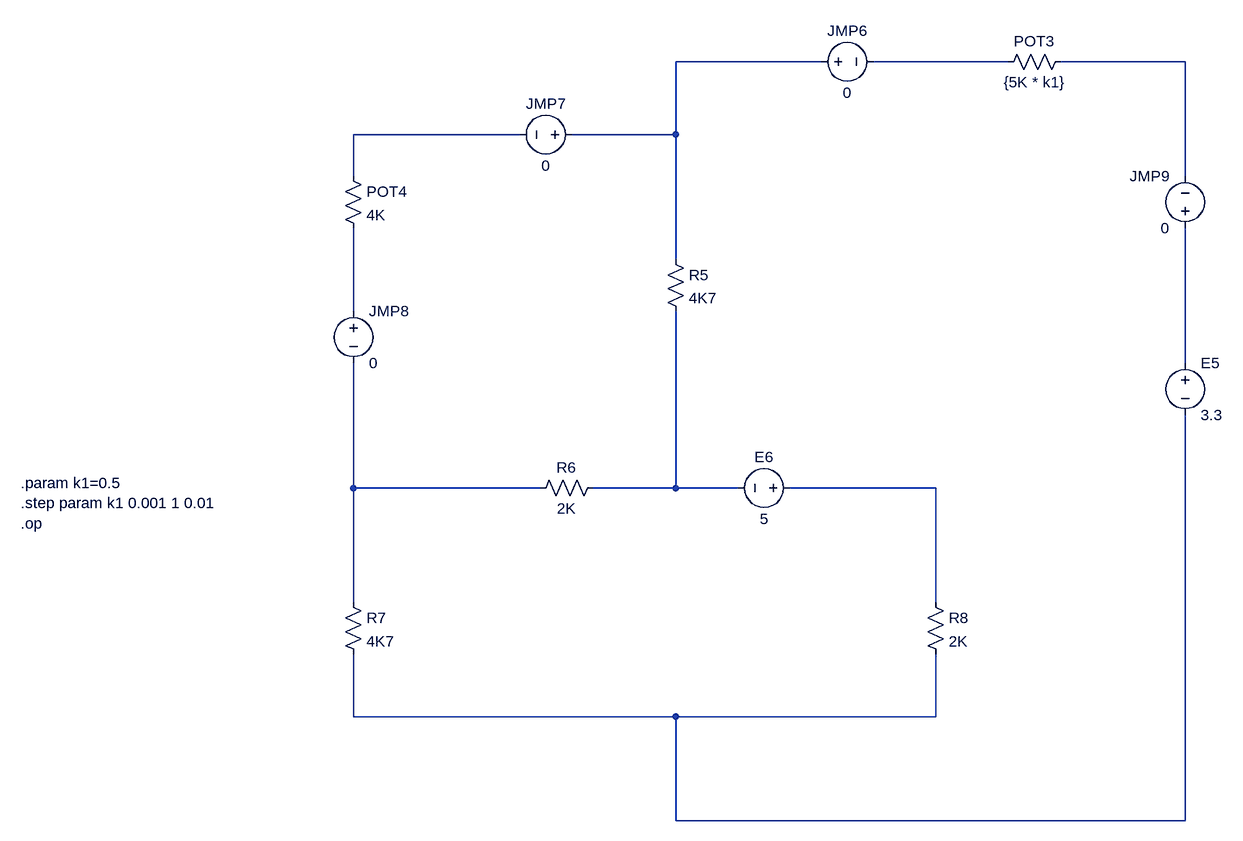
[diagram p0: schematic lab33.asc]
lab33.asc, the LTspice schematic file:
Version 4.1
SHEET 1 880 692
WIRE 208 -480 -16 -480
WIRE 496 -480 288 -480
WIRE 768 -480 576 -480
WIRE -256 -368 -512 -368
WIRE -16 -368 -16 -480
WIRE -16 -368 -176 -368
WIRE -512 -304 -512 -368
WIRE 768 -304 768 -480
WIRE -16 -176 -16 -368
WIRE -512 -96 -512 -224
WIRE 768 -16 768 -224
WIRE -512 176 -512 -16
WIRE -224 176 -512 176
WIRE -16 176 -16 -96
WIRE -16 176 -144 176
WIRE 80 176 -16 176
WIRE 384 176 160 176
WIRE -512 352 -512 176
WIRE 384 352 384 176
WIRE -512 528 -512 432
WIRE -16 528 -512 528
WIRE 384 528 384 432
WIRE 384 528 -16 528
WIRE -16 688 -16 528
WIRE 768 688 768 64
WIRE 768 688 -16 688
SYMBOL voltage 176 176 R90
WINDOW 0 -32 56 VBottom 2
WINDOW 3 32 56 VTop 2
WINDOW 123 0 0 Left 0
WINDOW 39 0 0 Left 0
SYMATTR InstName E6
SYMATTR Value 5
SYMBOL voltage 768 -32 R0
SYMATTR InstName E5
SYMATTR Value 3.3
SYMBOL res -528 336 R0
SYMATTR InstName R7
SYMATTR Value 4K7
SYMBOL res -128 160 R90
WINDOW 0 0 56 VBottom 2
WINDOW 3 32 56 VTop 2
SYMATTR InstName R6
SYMATTR Value 2K
SYMBOL res 368 336 R0
SYMATTR InstName R8
SYMATTR Value 2K
SYMBOL res -528 -320 R0
SYMATTR InstName POT4
SYMATTR Value 4K
SYMBOL res 592 -496 R90
WINDOW 0 0 56 VBottom 2
WINDOW 3 32 56 VTop 2
SYMATTR InstName POT3
SYMATTR Value {5K * k1}
SYMBOL res -32 -192 R0
SYMATTR InstName R5
SYMATTR Value 4K7
SYMBOL voltage -512 -112 R0
WINDOW 123 0 0 Left 0
WINDOW 39 0 0 Left 0
SYMATTR InstName JMP8
SYMATTR Value 0
SYMBOL voltage -160 -368 R90
WINDOW 0 -32 56 VBottom 2
WINDOW 3 32 56 VTop 2
WINDOW 123 0 0 Left 0
WINDOW 39 0 0 Left 0
SYMATTR InstName JMP7
SYMATTR Value 0
SYMBOL voltage 192 -480 R270
WINDOW 0 32 56 VTop 2
WINDOW 3 -32 56 VBottom 2
WINDOW 123 0 0 Left 0
WINDOW 39 0 0 Left 0
SYMATTR InstName JMP6
SYMATTR Value 0
SYMBOL voltage 768 -208 R180
WINDOW 0 24 96 Left 2
WINDOW 3 24 16 Left 2
WINDOW 123 0 0 Left 0
WINDOW 39 0 0 Left 0
SYMATTR InstName JMP9
SYMATTR Value 0
TEXT -1024 168 Left 2 !.param k1=0.5\n.step param k1 0.001 1 0.01\n.op

The netlist it stands for:
* lab33.asc
V§E6 N009 N008 5
V§E5 N006 N010 3.3
R7 N007 N010 4K7
R6 N008 N007 2K
R8 N009 N010 2K
R§POT4 N004 N005 4K
R§POT3 N003 N002 {5K * k1}
R5 N001 N008 4K7
V§JMP8 N005 N007 0
V§JMP7 N001 N004 0
V§JMP6 N001 N002 0
V§JMP9 N006 N003 0
.param k1=0.5
.step param k1 0.001 1 0.01
.op
.backanno
.end